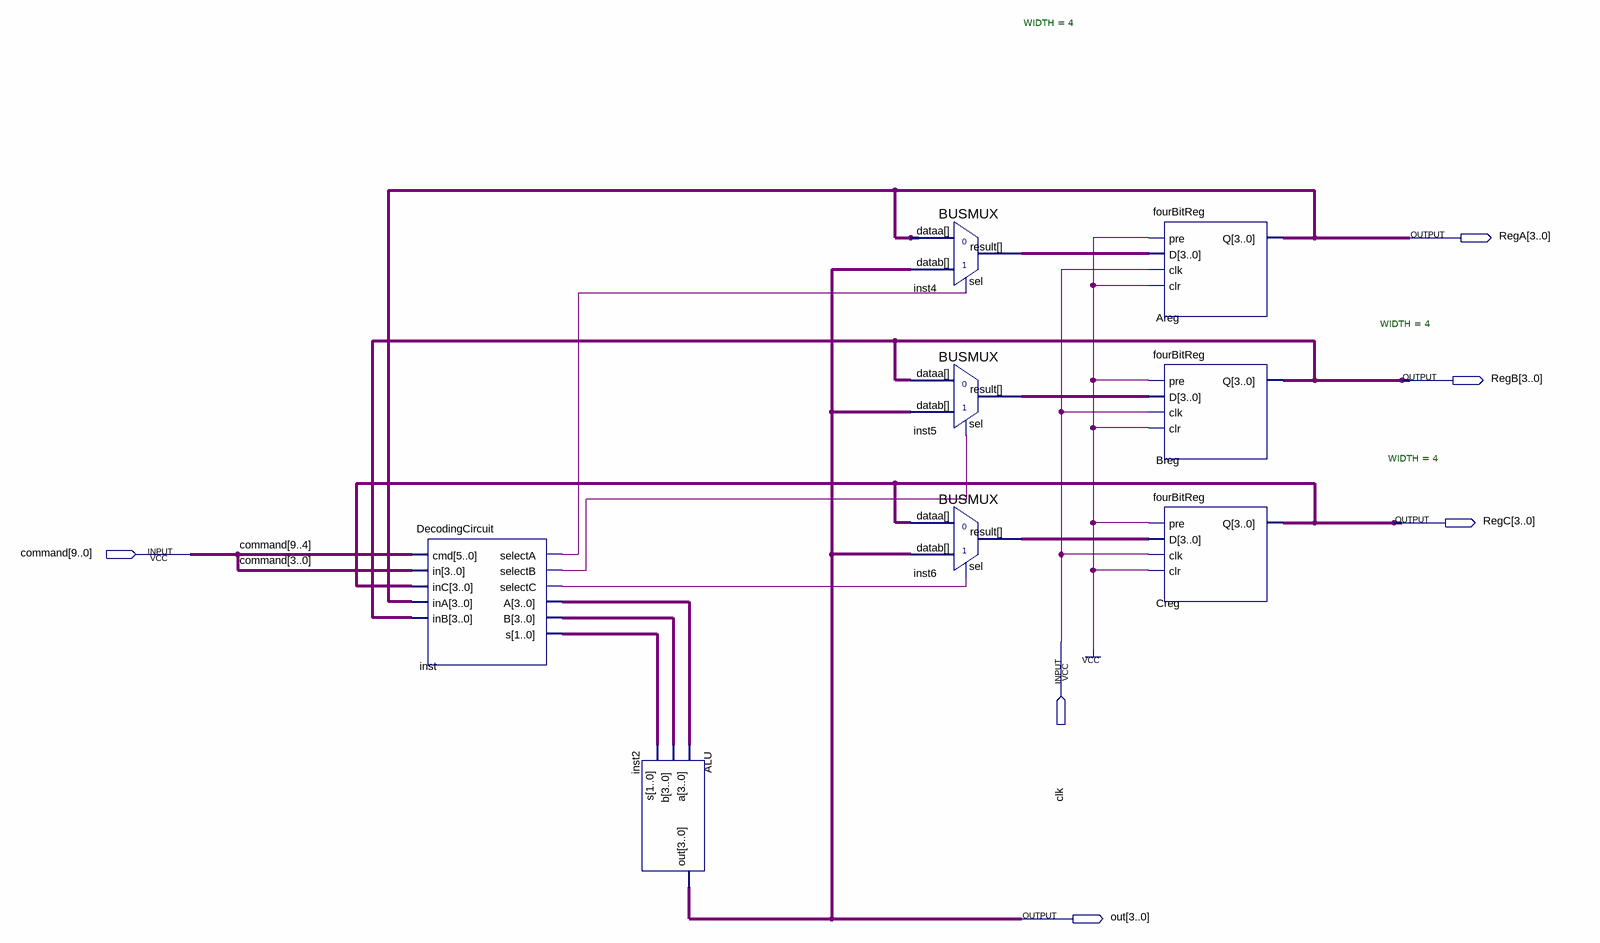
[diagram p0: schematic sheet]
// Quartus schematic EUBlockDiagram.bdf as structural Verilog: 8 symbols, 6 pins
module EUBlockDiagram (
  input  [9:0] command,
  input  clk,
  output [3:0] RegA,
  output [3:0] RegB,
  output [3:0] RegC,
  output [3:0] out
);

  wire inst_selecta, inst_selectb, inst_selectc;
  wire [1:0] inst_s;
  wire [3:0] inst4_result, inst5_result, inst6_result, inst_a, inst_b;

  DecodingCircuit inst (
    .cmd(command[9:4]), .in(command[3:0]), .inC(RegC), .inA(RegA), .inB(RegB), .selectA(inst_selecta),
    .selectB(inst_selectb), .selectC(inst_selectc), .A(inst_a), .B(inst_b), .s(inst_s));
  ALU inst2 (.a(inst_a), .b(inst_b), .s(inst_s), .out(out));
  BUSMUX #(.WIDTH(4)) inst4 (.datab(out), .sel(inst_selecta), .dataa(RegA), .result(inst4_result));
  BUSMUX #(.WIDTH(4)) inst5 (.datab(out), .sel(inst_selectb), .dataa(RegB), .result(inst5_result));
  BUSMUX #(.WIDTH(4)) inst6 (.datab(out), .sel(inst_selectc), .dataa(RegC), .result(inst6_result));
  fourBitReg Areg (.pre(1'b1), .D(inst4_result), .clk(clk), .clr(1'b1), .Q(RegA));
  fourBitReg Breg (.pre(1'b1), .D(inst5_result), .clk(clk), .clr(1'b1), .Q(RegB));
  fourBitReg Creg (.pre(1'b1), .D(inst6_result), .clk(clk), .clr(1'b1), .Q(RegC));
endmodule
